# Altium schematic sheet 7 segment.SchDoc: Reaturant Robot
size A4; Date: *******; ApprovedBy: *******; CheckedBy: Yasiru; Author: *******; CompanyName: *******; DrawnBy: Name; Engineer: *******; Organization: *******; Address1: *******; Address2: *******; Address3: *******; Address4: *******; DocumentNumber: 10; Revision: *******; SheetNumber: 9; SheetTotal: 11; Subtitle: 7 segment Display; Project: Reaturant Robot; VersionRevision: III; TotalSheet: 11; CurrentTime: *******; CurrentDate: *******; Time: *******; DocumentFullPathAndName: *******; DocumentName: *******; ModifiedDate: *******; ImagePath: *******; ProjectName: *******; Application_BuildNumber: *******
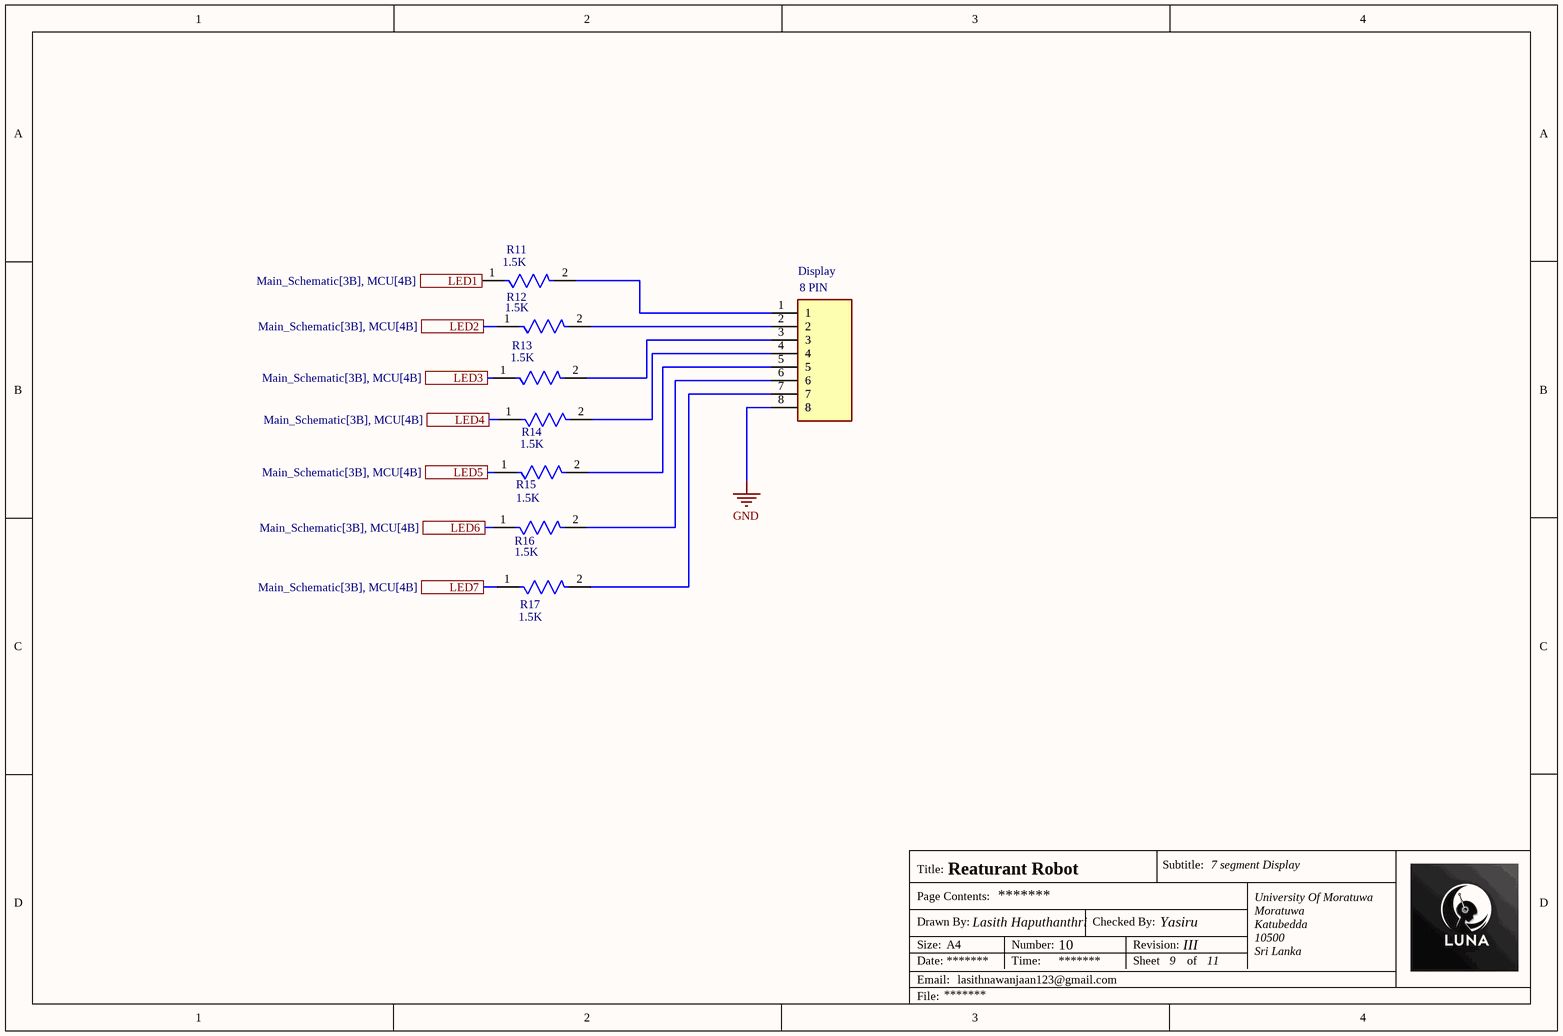
[diagram p0: 7 segment.SchDoc]

## Parts
Display  8 PIN  [SHDR8W60P0X250_1X8_2250X640X880P]
R11  1.5K  [FP-AF0603-IPC_B]
R12  1.5K  [FP-AF0603-IPC_B]
R13  1.5K  [FP-AF0603-IPC_B]
R14  1.5K  [FP-AF0603-IPC_B]
R15  1.5K  [FP-AF0603-IPC_B]
R16  1.5K  [FP-AF0603-IPC_B]
R17  1.5K  [FP-AF0603-IPC_B]

## Ports
LED1 (see Main_Schematic[3B], MCU[4B]), LED2 (see Main_Schematic[3B], MCU[4B]), LED3 (see Main_Schematic[3B], MCU[4B]), LED4 (see Main_Schematic[3B], MCU[4B]), LED5 (see Main_Schematic[3B], MCU[4B]), LED6 (see Main_Schematic[3B], MCU[4B]), LED7 (see Main_Schematic[3B], MCU[4B])

## Nets
GND: Display.8
LED1: R11.1 ; port LED1
LED2: R12.1 ; port LED2
LED3: R13.1 ; port LED3
LED4: R14.1 ; port LED4
LED5: R15.1 ; port LED5
LED6: R16.1 ; port LED6
LED7: R17.1 ; port LED7
NetDisplay_1: Display.1 R11.2
NetDisplay_2: Display.2 R12.2
NetDisplay_3: Display.3 R13.2
NetDisplay_4: Display.4 R14.2
NetDisplay_5: Display.5 R15.2
NetDisplay_6: Display.6 R16.2
NetDisplay_7: Display.7 R17.2

## Notes on the sheet
- Title:
- Drawn By:
- Page Contents:
- Checked By:
- Subtitle:
- University Of Moratuwa
- Moratuwa
- Size:
- Date:
- File:
- Email:
- A4
- lasithnawanjaan123@gmail.com
- Lasith Haputhanthri
- Number:
- Time:
- Revision:
- Sheet
- of
- Katubedda
- 10500
- Sri Lanka

## Library data of the parts
Display = B08B-XASK-1__LF__SN_: Connector; Manufacturer_Name: JST (JAPAN SOLDERLESS TERMINALS); Manufacturer_Part_Number: B08B-XASK-1 (LF)(SN); Datasheet Link: http://uk.rs-online.com/web/p/products/1667521; Height: 8.8mm
R11-R17 = CMP-03412-043191-1: Anti-Sulfurated Chip Resistors Automotive Grade 1.5kΩ 1% 100ppm/°C 0603; Resistance: 1.5kR; Max Power Dissipation: 100mW; Length: 0.063inch; Packaging: Tape and Reel; Tolerance: 1%; RoHS Compliant: Yes; Series: AF; Temperature Coefficient: 100ppm/°C; Case/Package: 0603; Height: 0.022inch; Min Operating Temperature: -55°C; Resistor Type: Thick Film; Features: Moisture Resistant; Width: 0.031inch; Number of Terminations: 2; Max Operating Temperature: 155°C